# EAGLE design BareBonesArduino-OtherMill-BottomOnly (EAGLE 8.0.0)
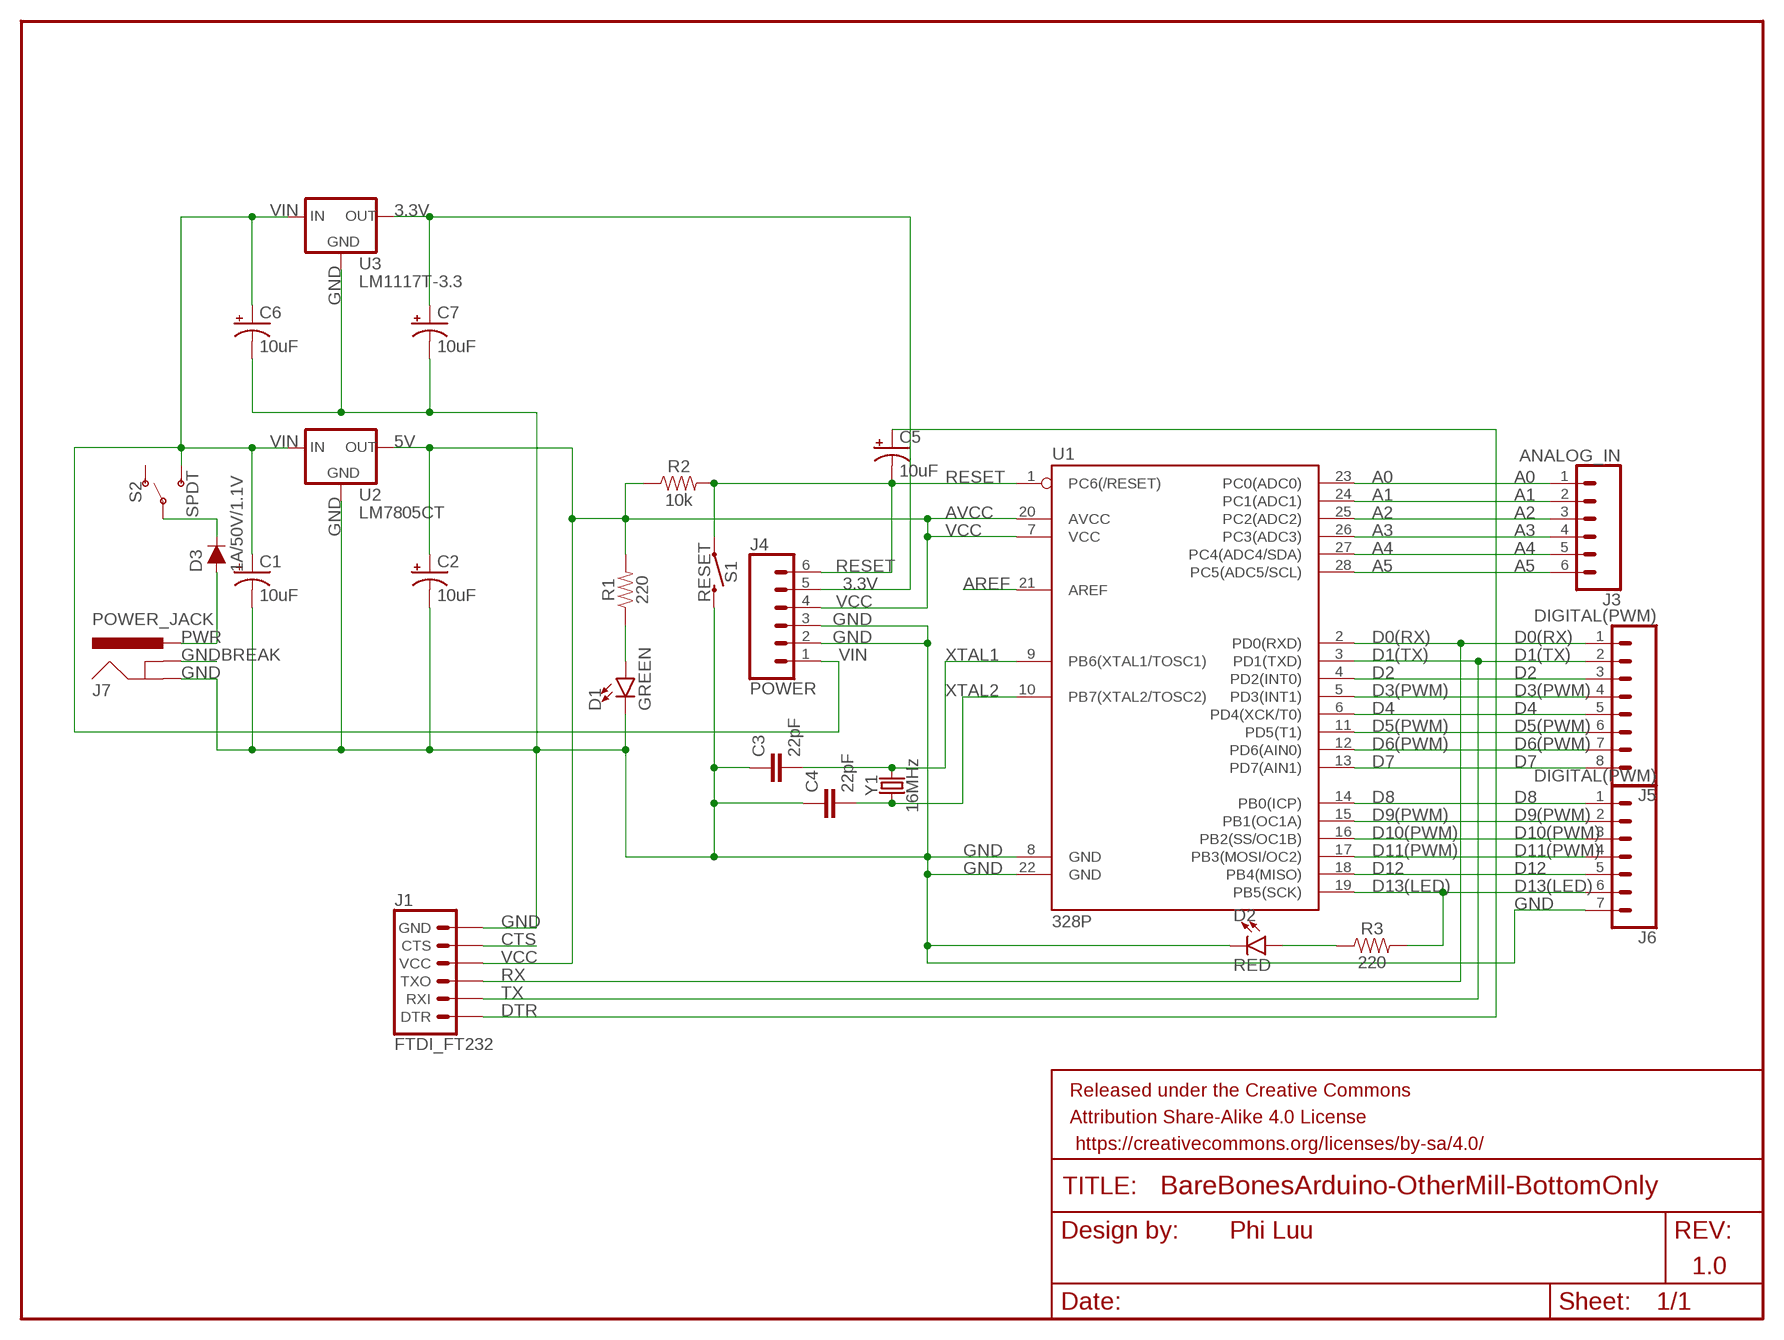
[diagram p0: schematic, sheet 1]

## Parts
C1  10uF  10UF-POLAR-RADIAL-2.5MM-25V-20%  [CPOL-RADIAL-2.5MM-5MM]
C2  10uF  10UF-POLAR-RADIAL-2.5MM-25V-20%  [CPOL-RADIAL-2.5MM-5MM]
C3  22pF  22PF-PTH-2.54MM-200V-5%  [CAP-PTH-2.54]
C4  22pF  22PF-PTH-2.54MM-200V-5%  [CAP-PTH-2.54]
C5  10uF  10UF-POLAR-RADIAL-2.5MM-25V-20%  [CPOL-RADIAL-2.5MM-5MM]
C6  10uF  10UF-POLAR-RADIAL-2.5MM-25V-20%  [CPOL-RADIAL-2.5MM-5MM]
C7  10uF  10UF-POLAR-RADIAL-2.5MM-25V-20%  [CPOL-RADIAL-2.5MM-5MM]
D1  GREEN  LED5MM  [LED_5MM]
D2  RED  LED5MM  [LED_5MM]
D3  1A/50V/1.1V  DIODE-PTH  [DIODE-1N4001]
FRAME1  FRAME-LETTER  [CREATIVE_COMMONS]
J1  FTDI_FT232  6_PIN_SERIAL_TARGET  [1X06]
J3  ANALOG_IN  CONN_06SILK_FEMALE_PTH  [1X06]
J4  POWER  CONN_06SILK_FEMALE_PTH  [1X06]
J5  DIGITAL(PWM)  CONN_08"  [1X08]
J6  DIGITAL(PWM)  CONN_07  [1X07]
J7  POWER_JACK  [POWER_JACK_PTH]
R1  220  1KOHM-HORIZ-1/4W-5%  [AXIAL-0.3]
R2  10k  10KOHM-HORIZ-1/4W-5%  [AXIAL-0.3]
R3  220  1KOHM-HORIZ-1/4W-5%  [AXIAL-0.3]
S1  RESET  MOMENTARY-SWITCH-SPST-PTH-6.0MM  [TACTILE_SWITCH_PTH_6.0MM]
S2  SPDT  SWITCH-SPDT-PTH-11.6X4.0MM  [SWITCH_SPDT_PTH_11.6X4.0MM]
U1  328P  ATMEGA328P_PDIP  [DIP28]
U2  LM7805CT  V_REG_78XX-TO-220  [TO-220-ALT]
U3  LM1117T-3.3  V_REG_LD1117VXX  [78XXL]
Y1  16MHz  CRYSTAL-16MHZPTH-HC49US  [HC49US]

## Nets
3.3V [power]: C7.1(+) J4.5 U3.GND(OUT)
A0: J3.1 U1.23(PC0(ADC0))
A1: J3.2 U1.24(PC1(ADC1))
A2: J3.3 U1.25(PC2(ADC2))
A3: J3.4 U1.26(PC3(ADC3))
A4: J3.5 U1.27(PC4(ADC4/SDA))
A5: J3.6 U1.28(PC5(ADC5/SCL))
AREF: U1.21(AREF)
CTS: J1.5(CTS)
D0(RX): J1.3(TXO) J5.1 U1.2(PD0(RXD))
D1(TX): J1.2(RXI) J5.2 U1.3(PD1(TXD))
D2: J5.3 U1.4(PD2(INT0))
D3(PWM): J5.4 U1.5(PD3(INT1))
D4: J5.5 U1.6(PD4(XCK/T0))
D5(PWM): J5.6 U1.11(PD5(T1))
D6(PWM): J5.7 U1.12(PD6(AIN0))
D7: J5.8 U1.13(PD7(AIN1))
D8: J6.1 U1.14(PB0(ICP))
D9(PWM): J6.2 U1.15(PB1(OC1A))
D10(PWM): J6.3 U1.16(PB2(SS/OC1B))
D11(PWM): J6.4 U1.17(PB3(MOSI/OC2))
D12: J6.5 U1.18(PB4(MISO))
D13(LED): J6.6 R3.P$2 U1.19(PB5(SCK))
DTR: C5.1(+) J1.1(DTR)
GND: C1.2(-) C2.2(-) C3.1 C4.1 C6.2(-) C7.2(-) D1.K(C) D2.K(C) J1.6(GND) J4.2 J4.3 J6.7 J7.GND S1.3 U1.8(GND) U1.22(GND) U2.GND U3.IN(GND)
GNDBREAK: J7.GNDBREAK
N$1: D2.A R3.P$1
N$2 [power]: D3.C S2.2(P)
N$3: D1.A R1.P$1
PWR [power]: D3.A J7.PWR
RESET: C5.2(-) J4.6 R2.P$2 S1.1 U1.1(PC6(/RESET))
VCC [power]: C2.1(+) J1.4(VCC) J4.4 R1.P$2 R2.P$1 U1.7(VCC) U1.20(AVCC) U2.OUT
VIN [power]: C1.1(+) C6.1(+) J4.1 S2.3(S) U2.IN U3.OUT(IN)
XTAL1: C3.2 U1.9(PB6(XTAL1/TOSC1)) Y1.2
XTAL2: C4.2 U1.10(PB7(XTAL2/TOSC2)) Y1.1
Unconnected: S2.1(O)

## Notes on the sheet
- 5V
- AVCC
- GND
- RX
- TX
- Phi Luu
- 1.0

## Library data of the parts
C1 C2 C5-C7 = SparkFun-Capacitors:10UF-POLAR: 10.0µF polarized capacitors A capacitor is a passive two-terminal electrical component used to store electrical energy temporarily in an electric field.; PROD_ID: CAP-08440
C3 C4 = SparkFun-Capacitors:22PF: 22pF ceramic capacitors A capacitor is a passive two-terminal electrical component used to store electrical energy temporarily in an electric field.; PROD_ID: CAP-09128
D1 D2 = SparkFun-LED:LED: LED (Generic) Standard schematic elements and footprints for 5mm, 3mm, 1206, and 0603 sized LEDs. Generic LEDs with no color specified.
D3 = SparkFun-DiscreteSemi:DIODE: Diode These are standard reverse protection diodes and small signal diodes. SparkFun Products: SparkFun SparkPunk Sound Kit <https://www.sparkfun.com/products/11177> SparkFun ESP8266 Thing <https://www.sparkfun.com/products/13231>; PROD_ID: DIO-09176
FRAME1 = SparkFun-Aesthetics:FRAME-LETTER: Schematic Frame - Letter Standard 8.5x11 US Letter frame
J1 = SparkFun-Connectors:6_PIN_SERIAL_TARGET: 6-pin header connection for use with the "FTDI BASIC" pinout - TARGET SIDE. Also known as "Arduino Serial Program Header". It is used to mate with our FTDI Basic serial programmers using the Arduino IDE. Note, this device has "TARGET" in the name. It is intended to be used on a design that contains a target micro-controller that you wish to program. The "sister" device, named "CABLE" is inteneded to be used on a design that usually lives on the end of your USB cable and prvides the converter chip (FTDI232 or FTDI231x) to commnicate serial RX/TX. You can populate with some of these: Break Away Headers - Straight <https://www.sparkfun.com/products/116> (PRT-00116) For reference (or to suit your programming needs) check out these designs: SparkFun FTDI Basic Breakout - 5V <https://www.sparkfun.com/products/9716> (DEV-09716) SparkFun FTDI Basic Breakout - 3.3V <https://www.sparkfun.com/products/9873> (DEV-09873) SparkFun FTDI SmartBasic <https://www.sparkfun.com/products/12935> (DEV-12935) SparkFun Beefy 3 - FTDI Basic Breakout <https://www.sparkfun.com/products/13746> (DEV-13746)
J3 J4 = SparkFun-Connectors:CONN_06: Multi connection point. Often used as Generic Header-pin footprint for 0.1 inch spaced/style header connections On any of the 0.1 inch spaced packages, you can populate with these: Break Away Headers - Straight <https://www.sparkfun.com/products/116> (PRT-00116) Break Away Male Headers - Right Angle <https://www.sparkfun.com/products/553> (PRT-00553) Female Headers <https://www.sparkfun.com/products/115> (PRT-00115) Break Away Headers - Machine Pin <https://www.sparkfun.com/products/117> (PRT-00117) Break Away Female Headers - Swiss Machine Pin <https://www.sparkfun.com/products/743> (PRT-00743) Arduino Stackable Header - 6 Pin <https://www.sparkfun.com/products/9280> (PRT-09280) For SCREWTERMINALS and SPRING TERMINALS visit here: Screw Terimnals on SparkFun.com <https://www.sparkfun.com/search/results?term=Screw+Terminals> (5mm/3.5mm/2.54mm spacing) This device is also useful as a general connection point to wire up your design to another part of your project. Our various solder wires solder well into these plated through hole pads. Hook-Up Wire - Assortment (Stranded, 22 AWG) <https://www.sparkfun.com/products/11375> (PRT-11375) Hook-Up Wire - Assortment (Solid Core, 22 AWG) <https://www.sparkfun.com/products/11367> (PRT-11367) View the entire wire category on our website here <https://www.sparkfun.com/categories/141>; PROD_ID: CONN-08437
J5 = SparkFun-Connectors:CONN_08: Multi connection point. Often used as Generic Header-pin footprint for 0.1 inch spaced/style header connections On any of the 0.1 inch spaced packages, you can populate with these: Break Away Headers - Straight <https://www.sparkfun.com/products/116> (PRT-00116) Break Away Male Headers - Right Angle <https://www.sparkfun.com/products/553> (PRT-00553) Female Headers <https://www.sparkfun.com/products/115> (PRT-00115) Break Away Headers - Machine Pin <https://www.sparkfun.com/products/117> (PRT-00117) Break Away Female Headers - Swiss Machine Pin <https://www.sparkfun.com/products/743> (PRT-00743) Arduino Stackable Header - 8 Pin <https://www.sparkfun.com/products/9279> (PRT-09279) For SCREWTERMINALS and SPRING TERMINALS visit here: Screw Terimnals on SparkFun.com <https://www.sparkfun.com/search/results?term=Screw+Terminals> (5mm/3.5mm/2.54mm spacing) This device is also useful as a general connection point to wire up your design to another part of your project. Our various solder wires solder well into these plated through hole pads. Hook-Up Wire - Assortment (Stranded, 22 AWG) <https://www.sparkfun.com/products/11375> (PRT-11375) Hook-Up Wire - Assortment (Solid Core, 22 AWG) <https://www.sparkfun.com/products/11367> (PRT-11367) View the entire wire category on our website here <https://www.sparkfun.com/categories/141> Special notes: Molex polarized connector foot print use with SKU : PRT-08231 with associated crimp pins and housings. 1MM SMD Version SKU: PRT-10208 NOTES ON THE VARIANTS LOCK and LOCK_LONGPADS... This footprint was designed to help hold the alignment of a through-hole component (i.e. 6-pin header) while soldering it into place. You may notice that each hole has been shifted either up or down by 0.005 of an inch from it's more standard position (which is a perfectly straight line). This slight alteration caused the pins (the squares in the middle) to touch the edges of the holes. Because they are alternating, it causes a "brace" to hold the component in place. 0.005 has proven to be the perfect amount of "off-center" position when using our standard breakaway headers. Although looks a little odd when you look at the bare footprint, once you have a header in there, the alteration is very hard to notice. Also,if you push a header all the way into place, it is covered up entirely on the bottom side.; PROD_ID: CONN-08438
J6 = SparkFun-Connectors:CONN_07: Multi connection point. Often used as Generic Header-pin footprint for 0.1 inch spaced/style header connections On any of the 0.1 inch spaced packages, you can populate with these: Break Away Headers - Straight <https://www.sparkfun.com/products/116> (PRT-00116) Break Away Male Headers - Right Angle <https://www.sparkfun.com/products/553> (PRT-00553) Female Headers <https://www.sparkfun.com/products/115> (PRT-00115) Break Away Headers - Machine Pin <https://www.sparkfun.com/products/117> (PRT-00117) Break Away Female Headers - Swiss Machine Pin <https://www.sparkfun.com/products/743> (PRT-00743) For SCREWTERMINALS and SPRING TERMINALS visit here: Screw Terimnals on SparkFun.com <https://www.sparkfun.com/search/results?term=Screw+Terminals> (5mm/3.5mm/2.54mm spacing) This device is also useful as a general connection point to wire up your design to another part of your project. Our various solder wires solder well into these plated through hole pads. Hook-Up Wire - Assortment (Stranded, 22 AWG) <https://www.sparkfun.com/products/11375> (PRT-11375) Hook-Up Wire - Assortment (Solid Core, 22 AWG) <https://www.sparkfun.com/products/11367> (PRT-11367) View the entire wire category on our website here <https://www.sparkfun.com/categories/141> Special notes: Molex polarized connector foot print use with SKU : PRT-08231 with associated crimp pins and housings. 1MM SMD Version SKU: PRT-10208 NOTES ON THE VARIANTS LOCK and LOCK_LONGPADS... This footprint was designed to help hold the alignment of a through-hole component (i.e. 6-pin header) while soldering it into place. You may notice that each hole has been shifted either up or down by 0.005 of an inch from it's more standard position (which is a perfectly straight line). This slight alteration caused the pins (the squares in the middle) to touch the edges of the holes. Because they are alternating, it causes a "brace" to hold the component in place. 0.005 has proven to be the perfect amount of "off-center" position when using our standard breakaway headers. Although looks a little odd when you look at the bare footprint, once you have a header in there, the alteration is very hard to notice. Also,if you push a header all the way into place, it is covered up entirely on the bottom side.
J7 = SparkFun-Connectors:POWER_JACK: Power Jack Connector This is the standard 5.5mm barrel jack for power. The PTH is the most common, proven, reliable, footprint. The Slot footprint only works if the mill layer is transmitted to the PCB fab house so be warned. Here are the connectors we sell at SparkFun: DC Barrel Power Jack/Connector <https://www.sparkfun.com/products/119> (PRT-00119) DC Barrel Power Jack/Connector (SMD) <https://www.sparkfun.com/products/12748> (PRT-12748) DC Barrel Jack Adapter - Breadboard Compatible <https://www.sparkfun.com/products/10811> (PRT-10811) It is used on this SparkFun product (and many, many others): SparkFun RedBoard - Programmed with Arduino <https://www.sparkfun.com/products/12757> (DEV-12757) Also, if you need a mating power supply or connector, please check these out: Wall Adapter Power Supply - 9VDC 650mA <https://www.sparkfun.com/products/298> (TOL-00298) DC Barrel Jack Adapter - Male <https://www.sparkfun.com/products/10287> (PRT-10287); PROD_ID: CONN-08197
R1 R3 = SparkFun-Resistors:1KOHM: 1kΩ resistor A resistor is a passive two-terminal electrical component that implements electrical resistance as a circuit element. Resistors act to reduce current flow, and, at the same time, act to lower voltage levels within circuits. - Wikipedia; PROD_ID: RES-08380; VALUE: 1k
R2 = SparkFun-Resistors:10KOHM: 10kΩ resistor A resistor is a passive two-terminal electrical component that implements electrical resistance as a circuit element. Resistors act to reduce current flow, and, at the same time, act to lower voltage levels within circuits. - Wikipedia; PROD_ID: RES-09435
S1 = SparkFun-Switches:MOMENTARY-SWITCH-SPST: Momentary Switch (Pushbutton) - SPST Normally-open (NO) SPST momentary switches (buttons, pushbuttons). Variants PTH-12MM - 12mm square, through-hole Momentary Pushbutton Switch - 12mm Square <https://www.sparkfun.com/products/9190> (COM-09190) PTH-6.0MM, PTH-6.0MM-KIT - 6.0mm square, through-hole Mini Pushbutton Switch <https://www.sparkfun.com/products/97> (COM-00097) KIT package intended for soldering kit's - only one side of pads' copper is exposed. PTH-RIGHT-ANGLE-KIT - Right-angle, through-hole Right Angle Tactile Button <https://www.sparkfun.com/products/10791> - Used on SparkFun BigTime Watch Kit <https://www.sparkfun.com/products/11734> SMD-12MM - 12mm square, surface-mount Tactile Button - SMD (12mm) <https://www.sparkfun.com/products/12993> (COM-12993) Used on SparkFun PicoBoard <https://www.sparkfun.com/products/11888> SMD-4.5MM - 4.5mm Square Trackball Switch Used on SparkFun Blackberry Trackballer Breakout <https://www.sparkfun.com/products/13169> SMD-4.6MMX2.8MM - 4.60mm x 2.80mm, surface mount Used on SparkFun SAMD21 Mini Breakout <https://www.sparkfun.com/products/13664> SMD-5.2MM, SMD-5.2-REDUNDANT - 5.2mm square, surface-mount Mini Pushbutton Switch - SMD <https://www.sparkfun.com/products/8720> (COM-08720) Used on Arduino Pro Mini <https://www.sparkfun.com/products/11114> REDUNDANT package connects both switch circuits together SMD-6.0X3.5MM - 6.0 x 3.5mm, surface mount Momentary Reset Switch SMD <https://www.sparkfun.com/products/8229> (COM-08229) SMD-6.2MM-TALL - 6.2mm square, surface mount Tactile Button - SMD (6mm) <https://www.sparkfun.com/products/12992> Used on SparkFun Digital Sandbox <https://www.sparkfun.com/products/12651> SMD-RIGHT-ANGLE - Right-angle, surface mount Used on SparkFun Block for Intel® Edison - Arduino <https://www.sparkfun.com/products/13036>; PROD_ID: SWCH-08441; SF_SKU: COM-00097
S2 = SparkFun-Switches:SWITCH-SPDT: Single Pole, Double Throw (SPDT) Switch Single-pole, double-throw (SPDT) switch. Variant Overview SMD-AYZ0202 Surface Mount DPDT Switch <https://www.sparkfun.com/products/597> (COM-00597) Used on e.g. LilyPad Arduino USB - ATmega32U4 Board <https://www.sparkfun.com/products/12049> PTH-11.6X4.0MM SPDT Mini Power Switch <https://www.sparkfun.com/products/102> (COM-00102) Used on e.g. SparkFun Simon Says - Through-Hole Soldering Kit <https://www.sparkfun.com/products/10547> (KIT-10547) PTH-11.6X4.0MM-KIT KIT version of SPDT Mini Power Switch - Simplifies soldering by removing tStop of switch pins - only one side can be soldered. PTH-11.6X4.0MM-LOCK LOCK version of SPDT Mini Power Switch - Offset pins hold switch in place for easier soldering. SMD-RIGHT-ANGLE Surface Mount Right Angle Switch <https://www.sparkfun.com/products/10860> (COM-10860) Used on e.g. SparkFun ESP8266 Thing <https://www.sparkfun.com/products/13231>; PROD_ID: SWCH-08261; SF_SKU: COM-00102
U1 = SparkFun-IC-Microcontroller:ATMEGA328P_PDIP: Atmel 328P Through hole ATMEGA328P uC used in the Arduino 32kb flash, 1k EEPROM, 2k SRAM Datasheet <http://www.sparkfun.com/datasheets/Components/SMD/ATMega328.pdf> SparkFun Products Storefront component: AVR 28 Pin 20MHz 32K 6A/D - ATMega328P <https://www.sparkfun.com/products/9061> (COM-09061) SparkFun Simon Says - Through-Hole Soldering Kit <https://www.sparkfun.com/products/10547> (KIT-10547) SparkFun Learn to Solder - Simon Says <https://www.sparkfun.com/products/13708> (KIT-13708) SparkFun BigTime Watch Kit <https://www.sparkfun.com/products/11734> (KIT-11734) SparkFun ClockIt <https://www.sparkfun.com/products/10930> (KIT-10930) SparkFun Serial Enabled LCD Kit <https://www.sparkfun.com/products/10097> (LCD-10097) SparkFun Simon Tilts - Through Hole Soldering Kit <https://www.sparkfun.com/products/12634> (KIT-12634) SparkFun Frequency Counter Kit <https://www.sparkfun.com/products/10140> (KIT-10140) FabFM Radio Kit <https://www.sparkfun.com/products/11043> (KIT-11043) SparkFun Binary Blaster Kit <https://www.sparkfun.com/products/12037> (KIT-12037) SparkFun Metro-Gnome <https://www.sparkfun.com/products/9236> (KIT-09236) ATmega328 with Arduino Optiboot (Uno) <https://www.sparkfun.com/products/10524> (DEV-10524); PROD_ID: IC-09136
U2 = SparkFun-IC-Power:V_REG_78XX: Voltage Regulator Standard 78xx regulator. IGO (Input Ground Output). Spark Fun Electronics SKU : COM-00107; PROD_ID: VREG-08450; SF_ID: COM-00107
U3 = SparkFun-IC-Power:V_REG_LD1117VXX: LD1117VXX voltage regulator. We carry the 3.3V version (COM-00526) in TO-220 package.
Y1 = SparkFun-Clocks:CRYSTAL-16MHZ: 16MHz Crystal Digikey Example <http://www.digikey.com/product-search/en?keywords=535-9122-1-ND> Frequency: 16MHz Frequency Stability: ±50ppm Frequency Tolerance: ±20ppm Load Capacitance: 18pF SparkFun Products: Pro Micro -5V/16MHz <https://www.sparkfun.com/products/12640> SparkFun Serial Enabled LCD Kit <https://www.sparkfun.com/products/10097>; PROD_ID: XTAL-08181; SF_ID: COM-00536

## Net classes
0 default: width 0.254 mm, clearance 0.254 mm
1 power: width 0.305 mm, clearance 0.254 mm

## Board
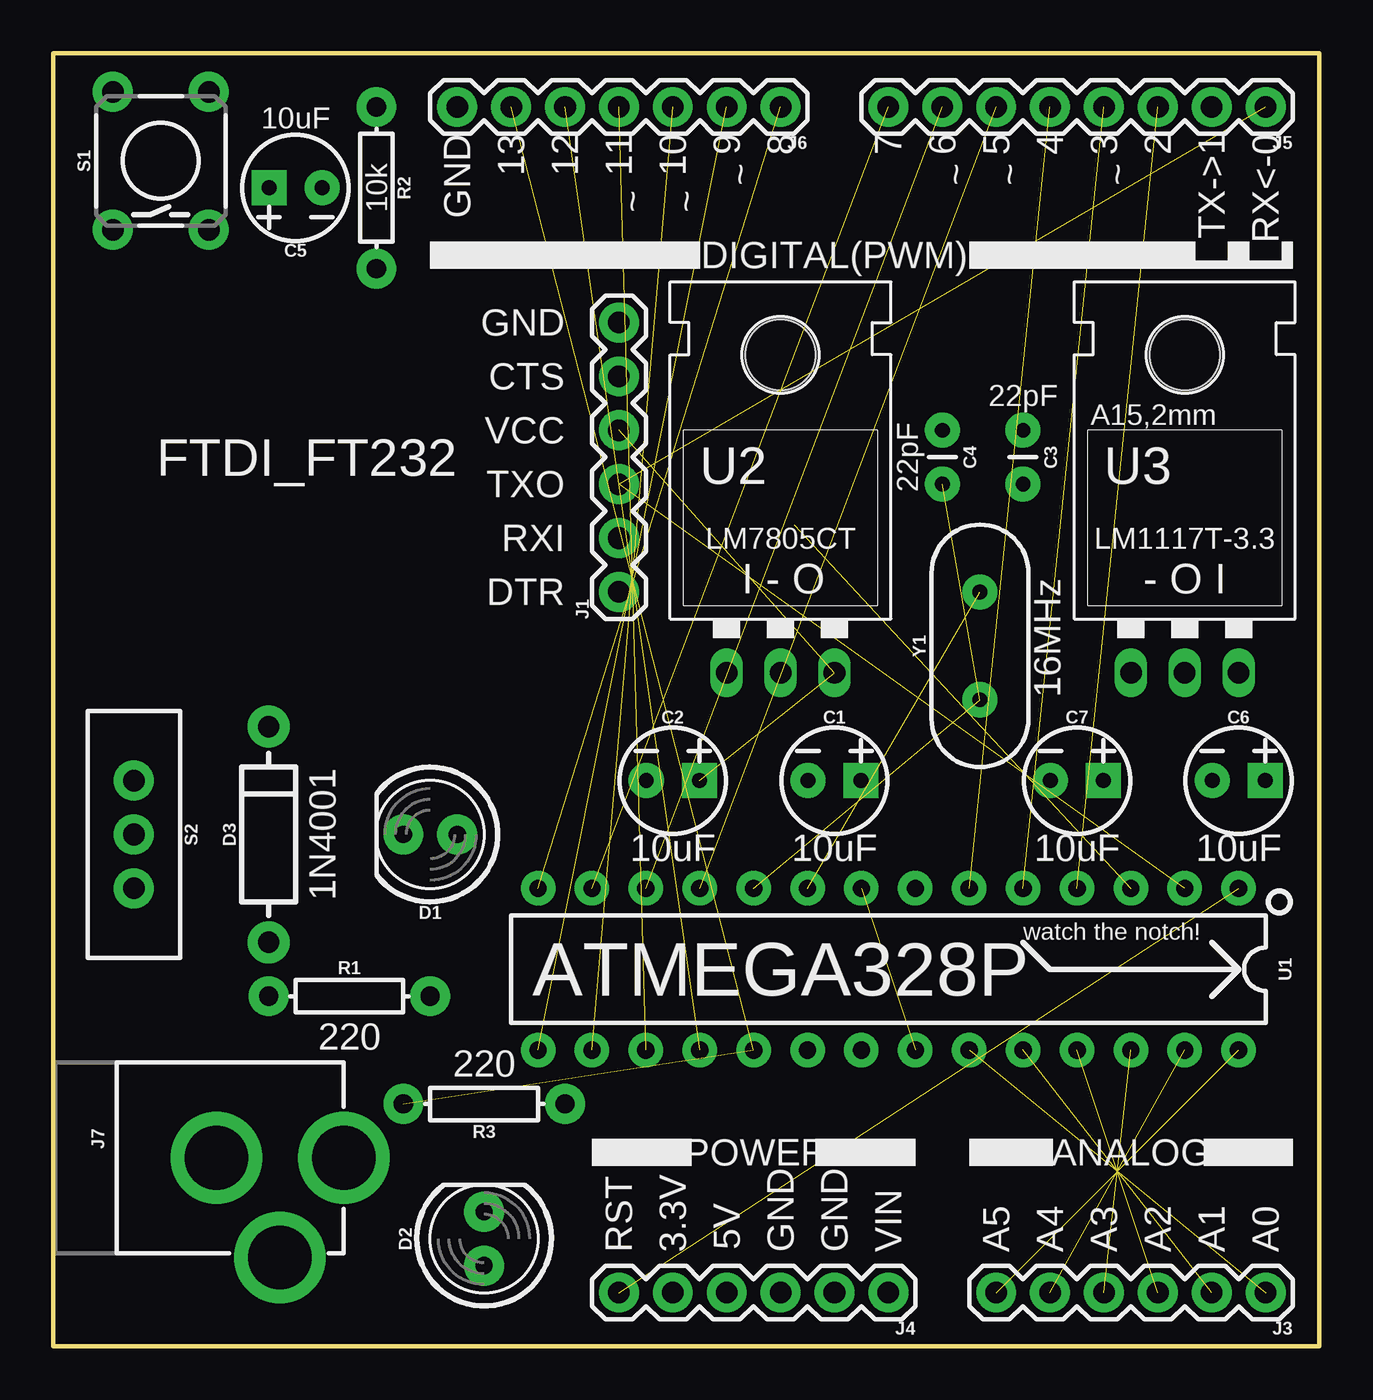
[diagram p1: board, top side]
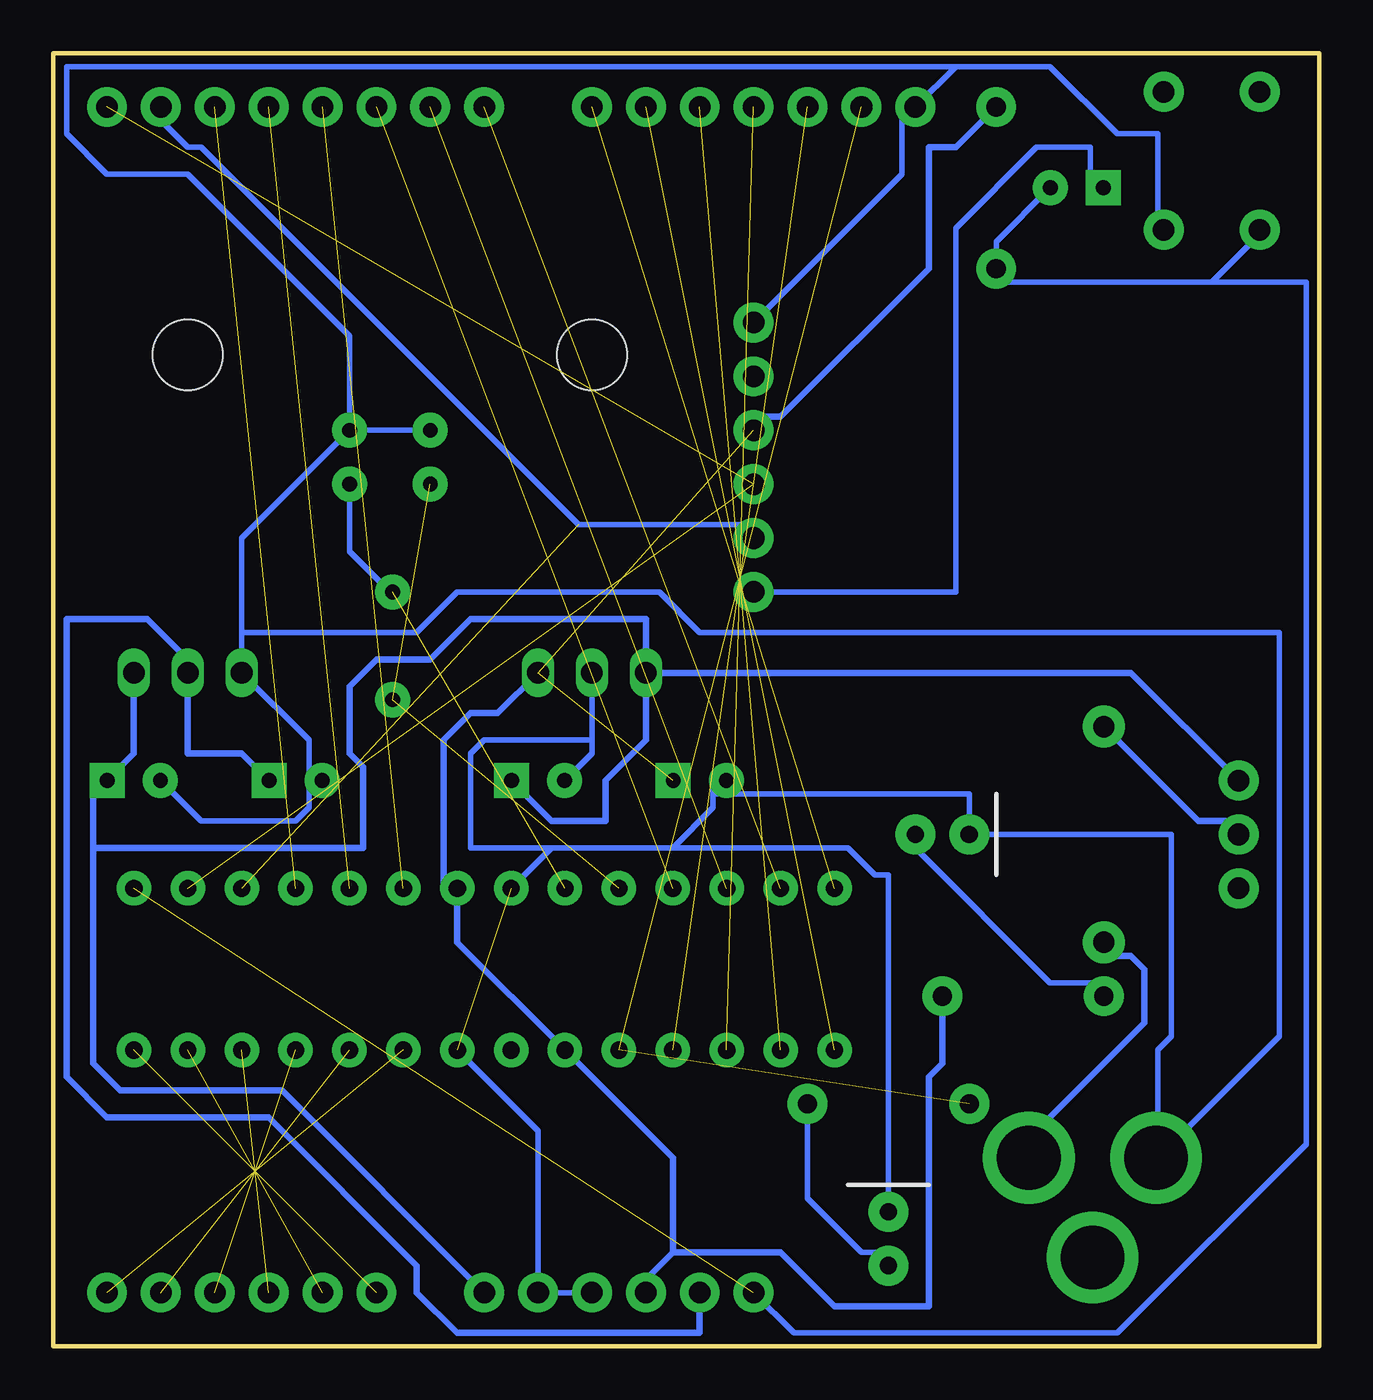
[diagram p2: board, bottom side, seen from below]

Size 59.69 x 60.96 mm. Coordinates in mm from the lower left corner, seen from the top.
Outline: 0,0 0,60.96 59.69,60.96 59.69,0 0,0
Copper layers (1*16): Top 0.035mm / dielectric 1.5mm / Bottom 0.035mm
Design rules "OthermillDRC_1_32_v2": minimum track width 8mil, minimum drill 0.8mm, track to track 0.794003125mm, track to pad 0.794003125mm, pad to pad 0.794003125mm, via to via 0.794003125mm, smd to smd 0mil, copper to edge 0mil, drill to drill 1mil, minimum pad ring 10mil, minimum via ring 10mil, stop-mask expansion 1mil, vias tented up to drill 30mil, thermal gap 10mil

### Footprints (pad centres in the part's own frame; a part is rotated, then mirrored left to right if it is on the bottom)
CPOL-RADIAL-2.5MM-5MM = drill 0.7 pad 1.651 square: 1 1.25,0 | drill 0.7 pad 1.651: 2 -1.25,0
CAP-PTH-2.54 = drill 0.7 pad 1.651: 1 -1.27,0; 2 1.27,0
LED_5MM = drill 0.813 pad 1.88: A -1.27,0; K 1.27,0
DIODE-1N4001 = drill 1 pad 1.981: A -5.08,0; C 5.08,0
1X06 = drill 1.016 pad 1.88: 1 0,0; 2 2.54,0; 3 5.08,0; 4 7.62,0; 5 10.16,0; 6 12.7,0
1X08 = drill 1.016 pad 1.88: 1 0,0; 2 2.54,0; 3 5.08,0; 4 7.62,0; 5 10.16,0; 6 12.7,0; 7 15.24,0; 8 17.78,0
1X07 = drill 1.016 pad 1.88: 1 0,0; 2 2.54,0; 3 5.08,0; 4 7.62,0; 5 10.16,0; 6 12.7,0; 7 15.24,0
POWER_JACK_PTH = drill 2.997 pad 4.318: GND 0,7.7; GNDBREAK 4.7,10.7; PWR 0,13.7
AXIAL-0.3 = drill 0.9 pad 1.88: P$1 -3.81,0; P$2 3.81,0
TACTILE_SWITCH_PTH_6.0MM = drill 1.016 pad 1.88: 1 -3.251,2.261; 2 3.251,2.261; 3 -3.251,-2.261; 4 3.251,-2.261
SWITCH_SPDT_PTH_11.6X4.0MM = drill 1.016 pad 1.88: 1 0,2.54; 2 0,0; 3 0,-2.54
DIP28 = drill 0.813 pad 1.626: 1 -16.51,-3.81; 2 -13.97,-3.81; 3 -11.43,-3.81; 4 -8.89,-3.81; 5 -6.35,-3.81; 6 -3.81,-3.81; 7 -1.27,-3.81; 8 1.27,-3.81; 9 3.81,-3.81; 10 6.35,-3.81; 11 8.89,-3.81; 12 11.43,-3.81; 13 13.97,-3.81; 14 16.51,-3.81; 15 16.51,3.81; 16 13.97,3.81; 17 11.43,3.81; 18 8.89,3.81; 19 6.35,3.81; 20 3.81,3.81; 21 1.27,3.81; 22 -1.27,3.81; 23 -3.81,3.81; 24 -6.35,3.81; 25 -8.89,3.81; 26 -11.43,3.81; 27 -13.97,3.81; 28 -16.51,3.81
TO-220-ALT = drill 1.016 long: GND 0,-3.81; IN -2.54,-3.81; OUT 2.54,-3.81 | hole 3.302: 0,11.176
78XXL = drill 1.016 long: GND 0,-3.81; IN -2.54,-3.81; OUT 2.54,-3.81 | hole 3.302: 0,11.176
HC49US = drill 0.7 pad 1.651: 1 -2.54,0; 2 2.54,0

### Placement (x,y rotation side)
C1  36.83,26.67 0 top
C2  29.21,26.67 0 top
C3  45.72,41.91 270 top
C4  41.91,41.91 270 top
C5  11.43,54.61 180 top
C6  55.88,26.67 0 top
C7  48.26,26.67 0 top
D1  17.78,24.13 180 top
D2  20.32,5.08 90 top
D3  10.16,24.13 90 top
FRAME1  1.27,-8.89 0 top  (outside the outline)
J1  26.67,35.56 90 top
J3  57.15,2.54 180 top
J4  39.37,2.54 180 top
J5  57.15,58.42 180 top
J6  34.29,58.42 180 top
J7  0,8.89 270 top
R1  13.97,16.51 0 top
R2  15.24,54.61 270 top
R3  20.32,11.43 180 top
S1  5.08,55.88 90 top
S2  3.81,24.13 180 top
U1  39.37,17.78 180 top
U2  34.29,35.56 0 top
U3  53.34,35.56 0 top
Y1  43.69,33.02 90 top

### Tracks (layer width: path | path; a pad name or v marks a point on that pad's centre or on a via)
3.3V
  Bottom 0.305: C7.1 49.53,26.67 50.8,27.94 53.34,27.94 U3.GND 53.34,32.38 55.24,34.29 59.05,34.29 59.05,12.7 57.15,10.79 49.53,10.79 42.55,3.81 42.55,2.54 40.64,0.64 29.21,0.64 J4.5
A0  (1 unrouted)
A1  (1 unrouted)
A2  (1 unrouted)
A3  (1 unrouted)
A4  (1 unrouted)
A5  (1 unrouted)
D0(RX)  (2 unrouted)
D1(TX)  (1 unrouted)
  Bottom 0.254: J1.2 27.3,38.73 34.92,38.73 52.7,56.52 53.34,56.52 54.61,57.78 J5.2
D2  (1 unrouted)
D3(PWM)  (1 unrouted)
D4  (1 unrouted)
D5(PWM)  (1 unrouted)
D6(PWM)  (1 unrouted)
D7  (1 unrouted)
D8  (1 unrouted)
D9(PWM)  (1 unrouted)
D10(PWM)  (1 unrouted)
D11(PWM)  (1 unrouted)
D12  (1 unrouted)
D13(LED)  (2 unrouted)
DTR
  Bottom 0.254: J1.1 17.14,35.56 17.14,52.7 13.34,56.52 10.79,56.52 10.79,54.61 C5.1
GND  (1 unrouted)
  Bottom 0.254: 34.29,28.57 34.29,27.94 35.56,26.67 C1.2 | 34.29,28.57 U2.GND | 36.2,23.5 U1.8 | 30.48,23.5 36.2,23.5 | 30.48,23.5 28.57,25.4 28.57,26.04 | 28.57,26.04 28.57,26.67 C2.2 | 28.57,26.04 16.51,26.04 D1.K 6.99,24.13 6.99,14.61 7.62,13.97 7.62,8.89 | D2.K 20.32,22.23 20.95,22.23 22.23,23.5 30.48,23.5 | 34.29,28.57 39.37,28.57 40.01,27.94 40.01,23.5 36.2,23.5 | C3.1 C4.1 | 47.62,26.67 47.62,28.57 U3.IN 50.8,33.66 | 47.62,26.67 47.62,25.4 48.26,24.77 52.7,24.77 54.61,26.67 C6.2 | 47.62,26.67 C7.2 | C3.1 50.8,38.1 50.8,33.66 | 17.14,60.33 12.7,60.33 9.53,57.15 7.62,57.15 7.62,52.7 S1.3 | 17.14,60.33 J6.7 19.68,58.42 19.68,55.24 J1.6 | C3.1 45.72,47.62 53.34,55.24 57.15,55.24 59.05,57.15 59.05,60.33 17.14,60.33 | 7.62,8.89 1.91,14.61 1.91,33.66 29.21,33.66 31.11,35.56 40.64,35.56 42.55,33.66 50.8,33.66 | 7.62,8.89 J7.GND | U1.22 36.83,10.16 J4.2 J4.3
N$1
  Bottom 0.254: D2.A 20.95,4.45 21.59,4.45 24.13,6.99 R3.P$1
N$2
  Bottom 0.305: S2.2 4.45,24.77 5.71,24.77 D3.C
N$3
  Bottom 0.254: R1.P$1 10.79,17.14 12.7,17.14 19.05,23.5 D1.A
PWR
  Bottom 0.305: D3.A 9.53,18.41 8.89,18.41 8.26,17.78 8.26,15.24 13.34,10.16 13.34,8.89 J7.PWR
RESET  (1 unrouted)
  Bottom 0.254: C5.2 12.7,54.61 15.24,52.07 R2.P$2 14.61,50.16 5.08,50.16 | 5.08,50.16 3.17,52.07 S1.1 | J4.6 24.77,0.64 9.53,0.64 0.64,9.53 0.64,50.16 5.08,50.16
VCC  (2 unrouted)
  Bottom 0.305: U2.OUT 38.73,29.84 40.01,29.84 41.27,28.57 41.27,21.59 U1.7 40.64,19.05 U1.20 30.48,8.89 30.48,4.45 | R1.P$2 17.78,13.34 18.41,12.7 18.41,1.91 22.86,1.91 25.4,4.45 30.48,4.45 | 30.48,4.45 31.75,3.17 J4.4 | J1.4 26.04,43.81 25.4,43.81 18.41,50.8 18.41,56.52 17.14,56.52 R2.P$1
VIN
  Bottom 0.305: U2.IN 31.75,28.57 33.66,26.67 33.66,24.77 36.2,24.77 38.1,26.67 C1.1 | S2.3 8.89,31.75 U2.IN | U3.OUT 55.88,27.94 57.15,26.67 | J4.1 48.9,12.06 56.52,12.06 57.78,13.34 57.78,23.5 | 57.78,23.5 57.78,26.67 57.15,26.67 | 57.15,26.67 C6.1 | U2.IN 31.75,34.29 40.01,34.29 41.91,32.38 44.45,32.38 45.72,31.11 45.72,27.94 45.09,27.3 45.09,23.5 57.78,23.5
XTAL1  (1 unrouted)
  Bottom 0.254: C3.2 45.72,37.47 43.81,35.56 Y1.2
XTAL2  (2 unrouted)

### Text on the board
tPlace: 10uF | GND | 13 | 12 | 11 | 10 | 9 | 8 | 7 | 6 | 5 | 4 | 3 | 2 | TX->1 | RX<-0 | 10k | ~ | ~ | ~ | ~ | ~ | ~ | DIGITAL(PWM) | GND | CTS | 22pF | VCC | FTDI_FT232 | 22pF | TXO | RXI | LM7805CT | LM1117T-3.3 | DTR | I - O | - O I | 16MHz | 1N4001 | 10uF | 10uF | 10uF | 10uF | watch the notch! | ATMEGA328P | 220 | 220 | POWER | ANALOG | 5V | RST | 3.3V | GND | GND | VIN | A5 | A4 | A3 | A2 | A1 | A0
tDocu: Phi Luu